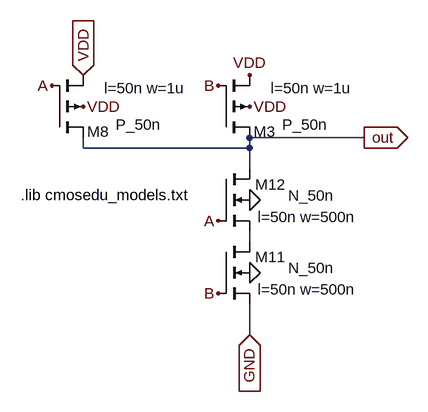
[diagram p0: schematic NAND_2.asc]
NAND_2.asc, the LTspice schematic file:
Version 4
SHEET 1 6288 680
WIRE 912 -400 912 -416
WIRE 1168 -400 912 -400
WIRE 1168 -400 1168 -416
WIRE 1168 -368 1168 -400
WIRE 1168 -256 1168 -272
WIRE 1168 -112 1168 -160
WIRE 1344 -416 1168 -416
FLAG 1168 -464 VDD
FLAG 912 -464 VDD
FLAG 1168 -208 0
FLAG 1168 -320 0
FLAG 1168 -512 VDD
FLAG 912 -512 VDD
IOPIN 912 -512 In
FLAG 1168 -112 GND
IOPIN 1168 -112 In
FLAG 1344 -416 out
IOPIN 1344 -416 Out
FLAG 864 -496 A
FLAG 1120 -288 A
FLAG 1120 -496 B
FLAG 1120 -176 B
SYMBOL pmos4 1120 -416 M180
WINDOW 0 88 9 Right 0
WINDOW 3 168 20 Right 0
WINDOW 123 206 76 Right 0
SYMATTR InstName M3
SYMATTR Value P_50n
SYMATTR Value2 l=50n w=1u
SYMBOL pmos4 864 -416 M180
WINDOW 0 88 9 Right 0
WINDOW 3 168 20 Right 0
WINDOW 123 206 76 Right 0
SYMATTR InstName M8
SYMATTR Value P_50n
SYMATTR Value2 l=50n w=1u
SYMBOL nmos4 1120 -256 R0
WINDOW 0 104 24 Right 0
WINDOW 3 179 41 Right 0
WINDOW 123 213 74 Right 0
SYMATTR InstName M11
SYMATTR Value N_50n
SYMATTR Value2 l=50n w=500n
SYMBOL nmos4 1120 -368 R0
WINDOW 0 104 24 Right 0
WINDOW 3 179 41 Right 0
WINDOW 123 213 74 Right 0
SYMATTR InstName M12
SYMATTR Value N_50n
SYMATTR Value2 l=50n w=500n
TEXT 816 -328 Left 0 !.lib cmosedu_models.txt

The netlist it stands for:
* NAND_2.asc
M3 out B VDD VDD P_50n l=50n w=1u
M8 out A VDD VDD P_50n l=50n w=1u
M11 N001 B GND 0 N_50n l=50n w=500n
M12 out A N001 0 N_50n l=50n w=500n
.model NMOS NMOS
.model PMOS PMOS
.lib standard.mos
.lib cmosedu_models.txt
.backanno
.end